# Altium schematic sheet ICSP connector.SchDoc
size A
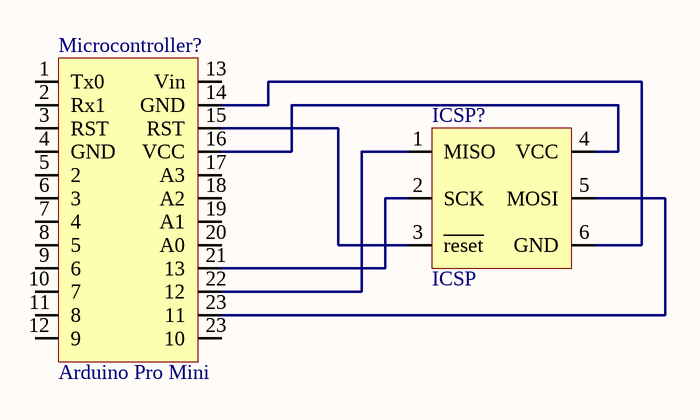
[diagram p0: ICSP connector.SchDoc]

## Parts
ICSP?  ICSP  [ICSP]
Microcontroller?  Arduino Pro Mini  [Arduino Pro Mini]

## Nets
NetICSP?_1: ICSP?.1(MISO) Microcontroller?.22(12)
NetICSP?_2: ICSP?.2(SCK) Microcontroller?.21(13)
NetICSP?_3: ICSP?.3(~{reset}) Microcontroller?.15(RST)
NetICSP?_4: ICSP?.4(VCC) Microcontroller?.16(VCC)
NetICSP?_5: ICSP?.5(MOSI) Microcontroller?.23(10)
NetICSP?_6: ICSP?.6(GND) Microcontroller?.14(GND)

Not connected (* = marked no-connect by the designer): Microcontroller? 1(Tx0) 2(Rx1) 3(RST) 4(GND) 5(2) 6(3) 7(4) 8(5) 9(6) 10(7) 11(8) 12(9) 13(Vin) 17(A3) 18(A2) 19(A1) 20(A0)

## Library data of the parts
ICSP? = ICSP: Header 6 pin